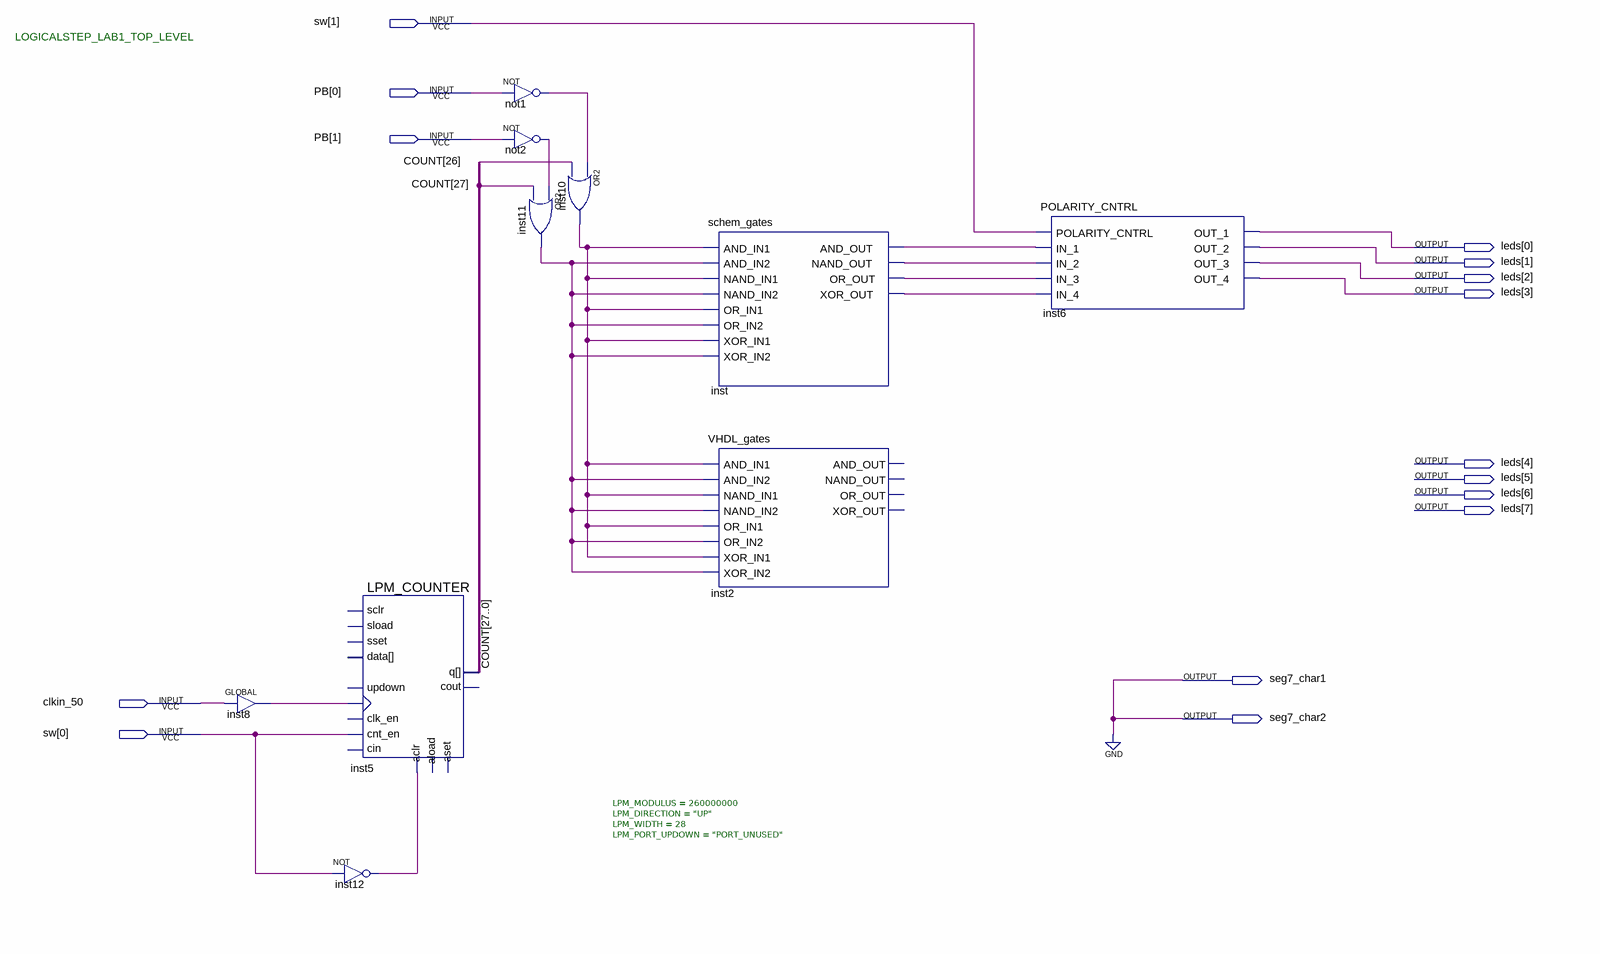
[diagram p0: schematic sheet]
// Quartus schematic LogicalStep_Lab1_top.bdf as structural Verilog: 10 symbols, 15 pins
module LogicalStep_Lab1_top (
  input  [1:0] sw,
  input  [1:0] PB,
  input  clkin_50,
  output [7:0] leds,
  output seg7_char1,
  output seg7_char2
);

  wire inst8_out, inst10_out, inst11_out, inst12_out, inst_and_out, inst_nand_out, inst_or_out, inst_xor_out,
       not1_out, not2_out;
  wire [27:0] COUNT;

  GLOBAL inst8 (.IN(clkin_50), .OUT(inst8_out));
  LPM_COUNTER #(.LPM_MODULUS(260000000), .LPM_DIRECTION("UP"), .LPM_WIDTH(28), .LPM_PORT_UPDOWN("PORT_UNUSED")) inst5 (
    .clock(inst8_out), .aclr(inst12_out), .cnt_en(sw[0]), .q(COUNT));  // open: sload, data, clk_en, aload, aset, cin, sset, updown, sclr, cout
  not inst12 (inst12_out, sw[0]);
  not not1 (not1_out, PB[0]);
  not not2 (not2_out, PB[1]);
  or inst10 (inst10_out, not1_out, COUNT[26]);
  or inst11 (inst11_out, not2_out, COUNT[27]);
  schem_gates inst (
    .AND_IN1(inst10_out), .AND_IN2(inst11_out), .NAND_IN1(inst10_out), .NAND_IN2(inst11_out),
    .OR_IN1(inst10_out), .OR_IN2(inst11_out), .XOR_IN1(inst10_out), .XOR_IN2(inst11_out),
    .AND_OUT(inst_and_out), .NAND_OUT(inst_nand_out), .OR_OUT(inst_or_out), .XOR_OUT(inst_xor_out));
  VHDL_gates inst2 (
    .AND_IN1(inst10_out), .AND_IN2(inst11_out), .NAND_IN1(inst10_out), .NAND_IN2(inst11_out),
    .OR_IN1(inst10_out), .OR_IN2(inst11_out), .XOR_IN1(inst10_out), .XOR_IN2(inst11_out));  // open: AND_OUT, NAND_OUT, OR_OUT, XOR_OUT
  POLARITY_CNTRL inst6 (
    .POLARITY_CNTRL(sw[1]), .IN_1(inst_and_out), .IN_2(inst_nand_out), .IN_3(inst_or_out),
    .IN_4(inst_xor_out), .OUT_1(leds[0]), .OUT_2(leds[1]), .OUT_3(leds[2]), .OUT_4(leds[3]));

  assign seg7_char1 = 1'b0;
  assign seg7_char2 = 1'b0;

  // Notes on the sheet:
  //   LOGICALSTEP_LAB1_TOP_LEVEL
endmodule
